# Altium schematic sheet [03] - MCU.SchDoc
size A3; DocumentNumber: 4; SheetNumber: 4; SheetTotal: 6
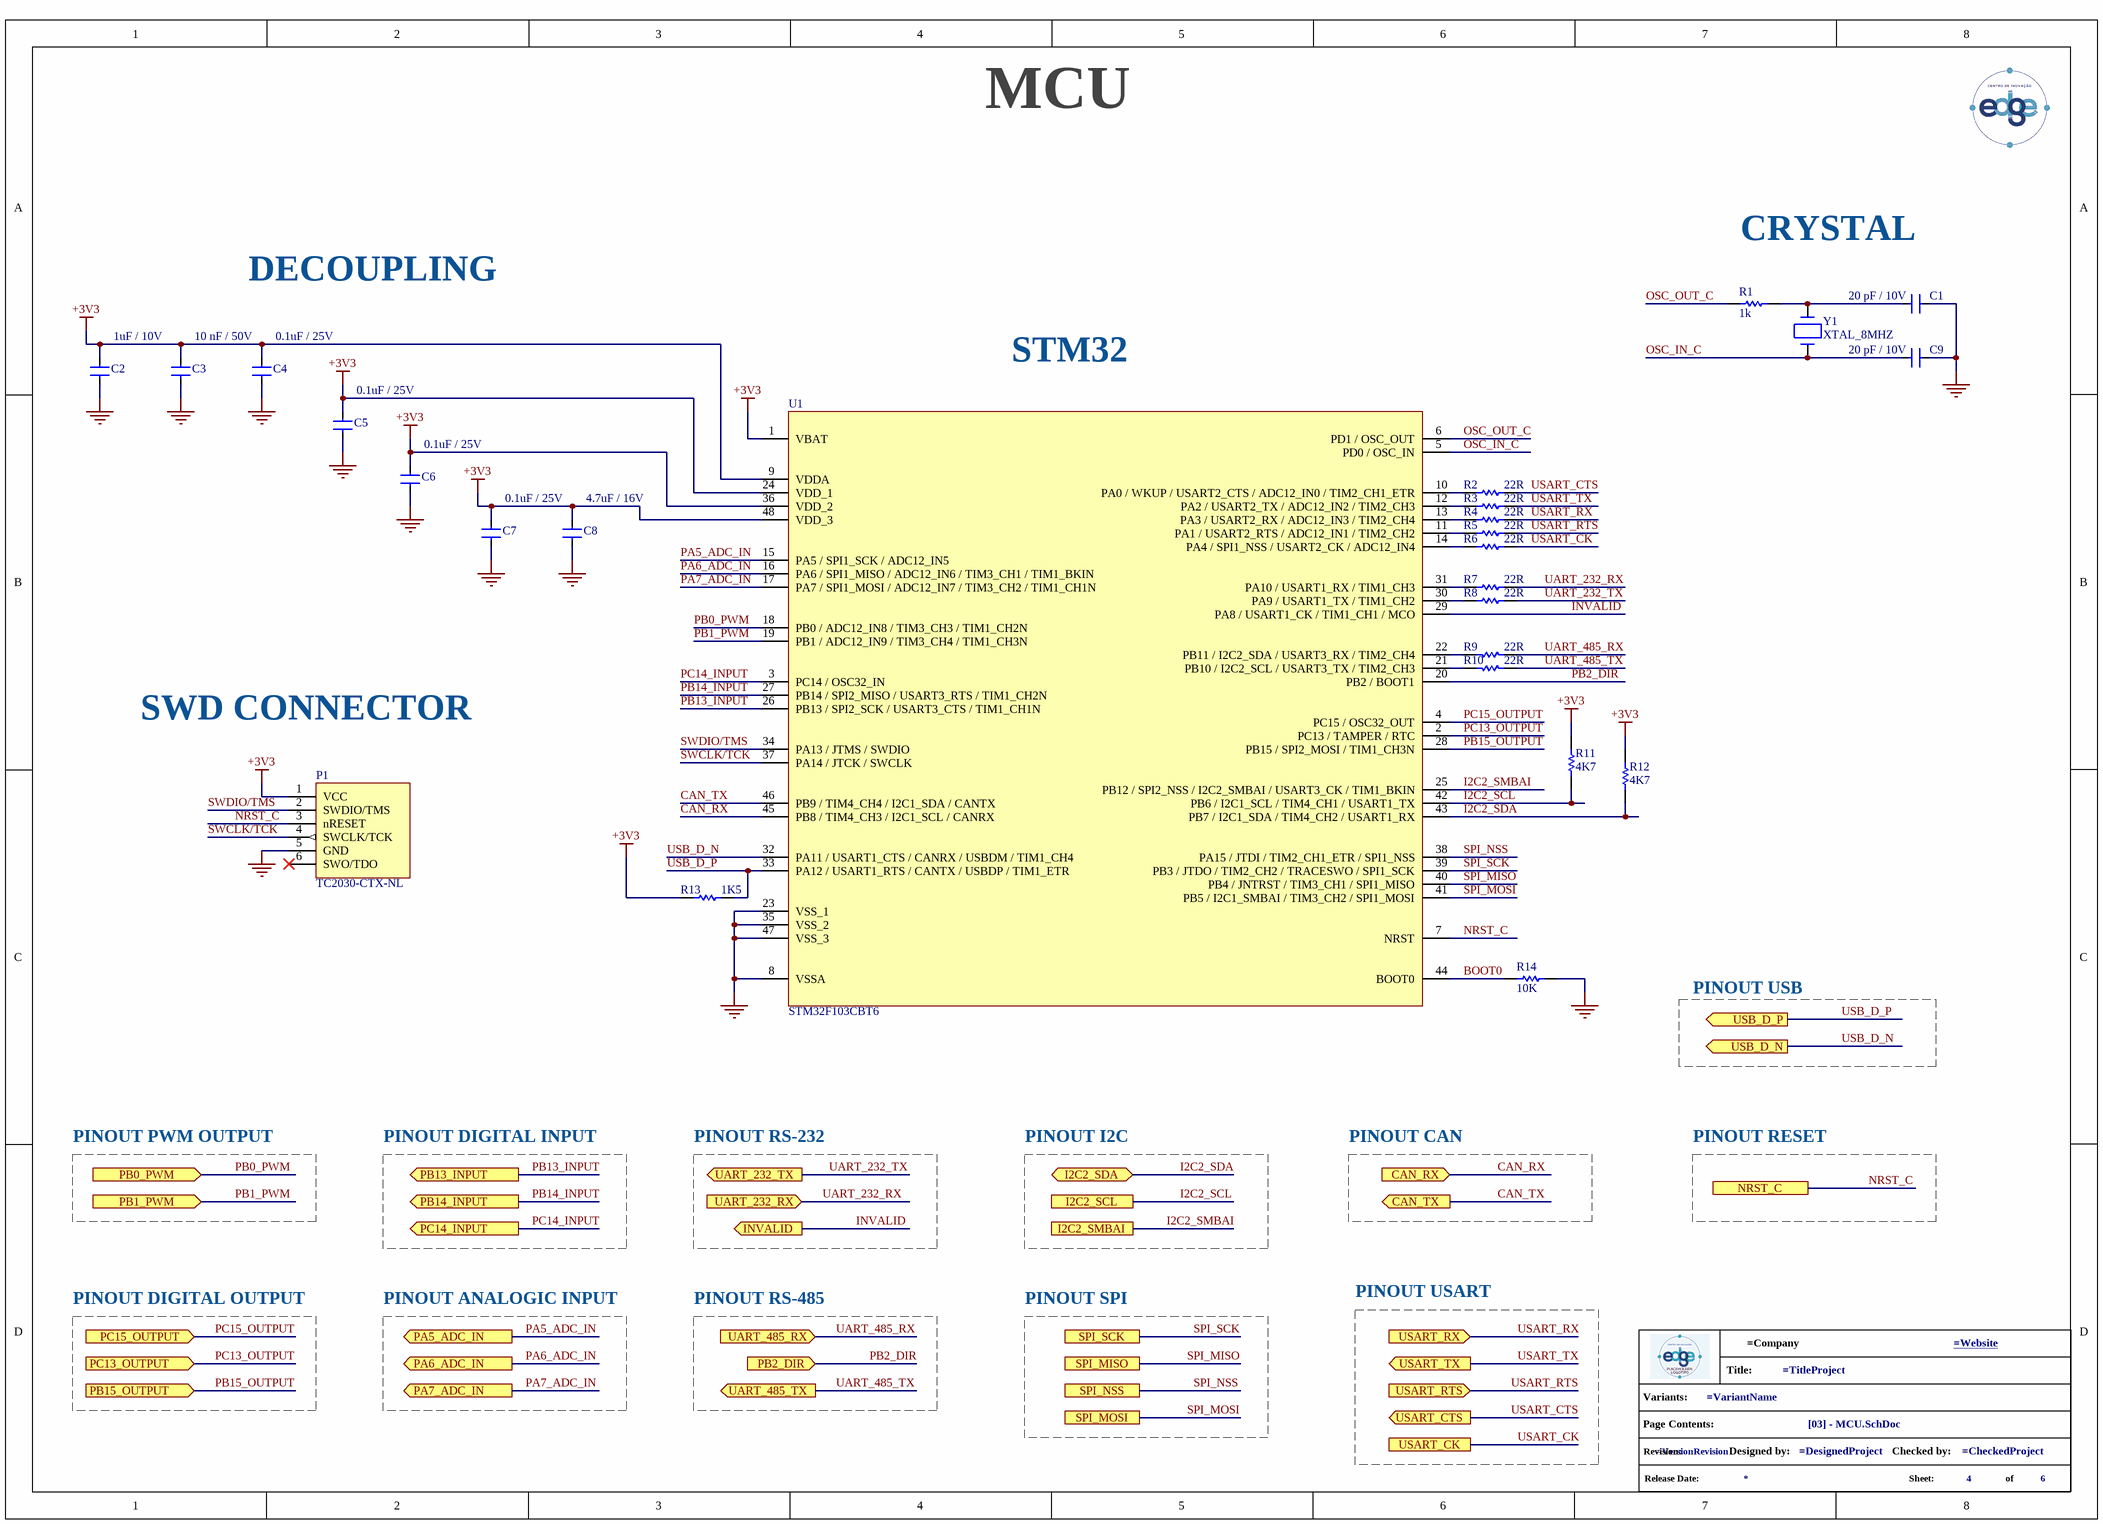
[diagram p0: [03] - MCU.SchDoc]

## Parts
*?  info_project  (value not drawn)  (graphical)
C1  20 pF / 10V  [C0805]
C2  1uF / 10V  [C0805]
C3  10 nF / 50V  [C0805]
C4  0.1uF / 25V  [C0805]
C5  0.1uF / 25V  [C0805]
C6  0.1uF / 25V  [C0805]
C7  0.1uF / 25V  [C0805]
C8  4.7uF / 16V  [C0805]
C9  20 pF / 10V  [C0805]
P1  TC2030-CTX-NL  [TC2030-CTX-NL]  (no BOM)
R1  1k  [R0805]
R2  22R  [R0805]
R3  22R  [R0805]
R4  22R  [R0805]
R5  22R  [R0805]
R6  22R  [R0805]
R7  22R  [R0805]
R8  22R  [R0805]
R9  22R  [R0805]
R10  22R  [R0805]
R11  4K7  [R0805]
R12  4K7  [R0805]
R13  1K5  [R0805]
R14  10K  [R0805]
U1  STM32F103CBT6  [STM32F103CBT6]
Y1  XTAL_8MHZ  [ABM7-8.000MHZ-D2Y-T]

## Ports
CAN_RX (in), CAN_TX (out), I2C2_SCL, I2C2_SDA (bidir), I2C2_SMBAI, INVALID (out), NRST_C, PA5_ADC_IN (out), PA6_ADC_IN (out), PA7_ADC_IN (out), PB0_PWM (in), PB1_PWM (in), PB2_DIR (in), PB13_INPUT (out), PB14_INPUT (out), PB15_OUTPUT (in), PC13_OUTPUT (in), PC14_INPUT (out), PC15_OUTPUT (in), SPI_MISO, SPI_MOSI, SPI_NSS, SPI_SCK, UART_232_RX (in), UART_232_TX (out), UART_485_RX (in), UART_485_TX (out), USART_CK, USART_CTS (out), USART_RTS (in), USART_RX (in), USART_TX (out), USB_D_N (out), USB_D_P (out)

## Nets
+3V3: C2.1 C3.1 C4.2 C5.2 C6.1 C7.1 C8.2 P1.1(VCC) R11.2 R12.2 R13.1 U1.1(VBAT) U1.9(VDDA) U1.24(VDD_1) U1.36(VDD_2) U1.48(VDD_3)
GND: C1.2 C2.2 C3.2 C4.1 C5.1 C6.2 C7.2 C8.1 C9.2 P1.5(GND) R14.1 U1.8(VSSA) U1.23(VSS_1) U1.35(VSS_2) U1.47(VSS_3)
BOOT0: R14.2 U1.44(BOOT0)
CAN_RX: U1.45(PB8_/_TIM4_CH3_/_I2C1_SCL_/_CANRX) ; port CAN_RX
CAN_TX: U1.46(PB9_/_TIM4_CH4_/_I2C1_SDA_/_CANTX) ; port CAN_TX
I2C2_SCL: R11.1 U1.42(PB6_/_I2C1_SCL_/_TIM4_CH1_/_USART1_TX) ; port I2C2_SCL
I2C2_SDA: R12.1 U1.43(PB7_/_I2C1_SDA_/_TIM4_CH2_/_USART1_RX) ; port I2C2_SDA
I2C2_SMBAI: U1.25(PB12_/_SPI2_NSS_/_I2C2_SMBAI_/_USART3_CK_/_TIM1_BKIN) ; port I2C2_SMBAI
INVALID: U1.29(PA8_/_USART1_CK_/_TIM1_CH1_/_MCO) ; port INVALID
NRST_C: P1.3(nRESET) U1.7(NRST) ; port NRST_C
OSC_IN_C: C9.1 U1.5(PD0_/_OSC_IN) Y1.1
OSC_OUT_C: R1.1 U1.6(PD1_/_OSC_OUT)
PA5_ADC_IN: U1.15(PA5_/_SPI1_SCK_/_ADC12_IN5) ; port PA5_ADC_IN
PA6_ADC_IN: U1.16(PA6_/_SPI1_MISO_/_ADC12_IN6_/_TIM3_CH1_/_TIM1_BKIN) ; port PA6_ADC_IN
PA7_ADC_IN: U1.17(PA7_/_SPI1_MOSI_/_ADC12_IN7_/_TIM3_CH2_/_TIM1_CH1N) ; port PA7_ADC_IN
PB0_PWM: U1.18(PB0_/_ADC12_IN8_/_TIM3_CH3_/_TIM1_CH2N) ; port PB0_PWM
PB1_PWM: U1.19(PB1_/_ADC12_IN9_/_TIM3_CH4_/_TIM1_CH3N) ; port PB1_PWM
PB2_DIR: U1.20(PB2_/_BOOT1) ; port PB2_DIR
PB13_INPUT: U1.26(PB13_/_SPI2_SCK_/_USART3_CTS_/_TIM1_CH1N) ; port PB13_INPUT
PB14_INPUT: U1.27(PB14_/_SPI2_MISO_/_USART3_RTS_/_TIM1_CH2N) ; port PB14_INPUT
PB15_OUTPUT: U1.28(PB15_/_SPI2_MOSI_/_TIM1_CH3N) ; port PB15_OUTPUT
PC13_OUTPUT: U1.2(PC13_/_TAMPER_/_RTC) ; port PC13_OUTPUT
PC14_INPUT: U1.3(PC14_/_OSC32_IN) ; port PC14_INPUT
PC15_OUTPUT: U1.4(PC15_/_OSC32_OUT) ; port PC15_OUTPUT
SPI_MISO: U1.40(PB4_/_JNTRST_/_TIM3_CH1_/_SPI1_MISO) ; port SPI_MISO
SPI_MOSI: U1.41(PB5_/_I2C1_SMBAI_/_TIM3_CH2_/_SPI1_MOSI) ; port SPI_MOSI
SPI_NSS: U1.38(PA15_/_JTDI_/_TIM2_CH1_ETR_/_SPI1_NSS) ; port SPI_NSS
SPI_SCK: U1.39(PB3_/_JTDO_/_TIM2_CH2_/_TRACESWO_/_SPI1_SCK) ; port SPI_SCK
SWCLK/TCK: P1.4(SWCLK/TCK) U1.37(PA14_/_JTCK_/_SWCLK)
SWDIO/TMS: P1.2(SWDIO/TMS) U1.34(PA13_/_JTMS_/_SWDIO)
UART_232_RX: R7.2 ; port UART_232_RX
UART_232_TX: R8.2 ; port UART_232_TX
UART_485_RX: R9.1 ; port UART_485_RX
UART_485_TX: R10.1 ; port UART_485_TX
USART_CK: R6.1 ; port USART_CK
USART_CTS: R2.1 ; port USART_CTS
USART_RTS: R5.1 ; port USART_RTS
USART_RX: R4.1 ; port USART_RX
USART_TX: R3.1 ; port USART_TX
USB_D_N: U1.32(PA11_/_USART1_CTS_/_CANRX_/_USBDM_/_TIM1_CH4) ; port USB_D_N
USB_D_P: R13.2 U1.33(PA12_/_USART1_RTS_/_CANTX_/_USBDP_/_TIM1_ETR) ; port USB_D_P
NetC1_1: C1.1 R1.2 Y1.2
NetR2_2: R2.2 U1.10(PA0_/_WKUP_/_USART2_CTS_/_ADC12_IN0_/_TIM2_CH1_ETR)
NetR3_2: R3.2 U1.12(PA2_/_USART2_TX_/_ADC12_IN2_/_TIM2_CH3)
NetR4_2: R4.2 U1.13(PA3_/_USART2_RX_/_ADC12_IN3_/_TIM2_CH4)
NetR5_2: R5.2 U1.11(PA1_/_USART2_RTS_/_ADC12_IN1_/_TIM2_CH2)
NetR6_2: R6.2 U1.14(PA4_/_SPI1_NSS_/_USART2_CK_/_ADC12_IN4)
NetR7_1: R7.1 U1.31(PA10_/_USART1_RX_/_TIM1_CH3)
NetR8_1: R8.1 U1.30(PA9_/_USART1_TX_/_TIM1_CH2)
NetR9_2: R9.2 U1.22(PB11_/_I2C2_SDA_/_USART3_RX_/_TIM2_CH4)
NetR10_2: R10.2 U1.21(PB10_/_I2C2_SCL_/_USART3_TX_/_TIM2_CH3)

Not connected (* = marked no-connect by the designer): P1 6(SWO/TDO)*

## Notes on the sheet
- MCU
- CRYSTAL
- DECOUPLING
- STM32
- SWD CONNECTOR
- PINOUT USB
- PINOUT PWM OUTPUT
- PINOUT DIGITAL INPUT
- PINOUT RS-232
- PINOUT I2C
- PINOUT CAN
- PINOUT RESET
- PINOUT DIGITAL OUTPUT
- PINOUT ANALOGIC INPUT
- PINOUT RS-485
- PINOUT SPI
- PINOUT USART
- (in symbol info_project) Title:; Variants:; Page Contents:; Revision:; Designed by:; Checked by:; Release Date:; Sheet:; of

## Library data of the parts
C1 C9 = C0805C200G8HAC7800: MLCC - 20pF 10V 0805 X8R +/- 2%; Manufacturer: KEMET; Supplier 1: Digi-Key; Manufacturer Part Number: C0805C200G8HAC7800; RoHS: No; Stock 1: 11310; Pricing 1: 1=0,18000, 10=0,12800, 50=0,07240, 100=0,06000, 500=0,04208, 1000=0,03484 (USD); Supplier Part Number 1: 399-C0805C200G8HAC7800CT-ND
C2 = LMF212B7105KGHT: MLCC - 1uF 10V 0805   X7R +/- 10%; Manufacturer: Taiyo Yuden; Supplier 1: Digi-Key; Manufacturer Part Number: LMF212B7105KGHT; RoHS: Yes; Stock 1: 5962; Pricing 1: 1=0.31000, 10=0.21100, 50=0.14040, 100=0.11930, 500=0.08422, 1000=0.07369 (USD); RoHS Compliant: Yes; Supplier Part Number 1: 587-6522-1-ND
C3 = C0805C103J5GEC7800: MLCC - 10nF 50V 0805 C0G +/- 5%; Manufacturer: KEMET; Supplier 1: Digi-Key; Manufacturer Part Number: C0805C103J5GEC7800; RoHS: No; Stock 1: 1119; Pricing 1: 1=0.31000, 10=0.21500, 50=0.14300, 100=0.12160, 500=0.08584, 1000=0.07511 (USD); Supplier Part Number 1: 399-C0805C103J5GEC7800CT-ND
C4-C7 = CC0805KRX7R8BB104: MLCC - 0.1uF 25V 0805 X7R +/- 10%; Manufacturer: Yageo; Material: Ceramic; Capacitance: 100nF; Insulation Resistance: 100GR; Supplier 1: Digi-Key; Manufacturer Part Number: CC0805KRX7R8BB104; RoHS: Yes; Category: Ceramic Capacitors; Stock 1: 331734; Pricing 1: 1=0,12000, 10=0,08800, 50=0,04980, 100=0,04130, 500=0,02894, 1000=0,02396 (USD); Mount: Surface Mount; Case/Package: 0805; Number of Pins: 2; Case Code (Metric): 2012; Case Code (Imperial): 0805; Min Operating Temperature: -55°C; Max Operating Temperature: 125°C; Tolerance: 10%; Dielectric: X7R; Series: CC; Package Quantity: 1; Voltage Rating: 25V; Packaging: Tape and Reel; Voltage Rating (DC): 25V; Termination: SMD/SMT; Resistor Type: Ceramic; Length: 2mm; Width: 0.049inch; Height: 0.85mm; Depth: 1.25mm; Thickness: 0.033inch; Radiation Hardening: No; RoHS Compliant: Yes; REACH SVHC: No SVHC; Lead Free: Lead Free; Halogen Free: Halogen Free; ComponentLink1URL: https://datasheet.ciiva.com/145/mlccorderingcode-145007.pdf?src-supplier=Digi-Key; ComponentLink1Description: https://datasheet.ciiva.com/145/mlccorderingcode-145007.pdf?src-supplier=Digi-Key; ComponentLink2URL: https://datasheet.ciiva.com/145/mlccorderingcode-145008.pdf?src-supplier=Digi-Key; ComponentLink2Description: https://datasheet.ciiva.com/145/mlccorderingcode-145008.pdf?src-supplier=Digi-Key; ComponentLink3URL: https://datasheet.ciiva.com/145/mlccorderingcode-145009.pdf?src-supplier=Digi-Key; ComponentLink3Description: https://datasheet.ciiva.com/145/mlccorderingcode-145009.pdf?src-supplier=Digi-Key; ComponentLink4URL: https://datasheet.ciiva.com/8034/1784427-8034029.pdf?src-supplier=Element14; ComponentLink4Description: https://datasheet.ciiva.com/8034/1784427-8034029.pdf?src-supplier=Element14; ComponentLink5URL: https://datasheet.ciiva.com/8034/1784427-8034030.pdf?src-supplier=Element14; ComponentLink5Description: https://datasheet.ciiva.com/8034/1784427-8034030.pdf?src-supplier=Element14; ComponentLink6URL: https://datasheet.ciiva.com/8034/70765-8034031.pdf?src-supplier=Element14; ComponentLink6Description: https://datasheet.ciiva.com/8034/70765-8034031.pdf?src-supplier=Element14; ComponentLink7URL: https://datasheet.ciiva.com/46430/1850775-46430166.pdf?src-supplier=Element14; ComponentLink7Description: https://datasheet.ciiva.com/46430/1850775-46430166.pdf?src-supplier=Element14; ComponentLink8URL: https://datasheet.ciiva.com/28450/1489800-28450789.pdf?src-supplier=Element14; ComponentLink8Description: https://datasheet.ciiva.com/28450/1489800-28450789.pdf?src-supplier=Element14; ComponentLink9URL: https://datasheet.ciiva.com/15189/getdatasheetpartid-330244-15189223.pdf?src-supplier=Verical; ComponentLink9Description: https://datasheet.ciiva.com/15189/getdatasheetpartid-330244-15189223.pdf?src-supplier=Verical; ComponentLink10URL: https://datasheet.ciiva.com/16625/upy-gphc-x7r-6-3v-to-50v-8-16625546.pdf?src-supplier=Avnet+Europe; ComponentLink10Description: https://datasheet.ciiva.com/16625/upy-gphc-x7r-6-3v-to-50v-8-16625546.pdf?src-supplier=Avnet+Europe; Supplier Part Number 1: 311-1141-1-ND
C8 = GCM21BR71C475KA73L: MLCC - 4.7uF 16V 0805 X7R +/- 10%; Manufacturer: Murata; Supplier 1: Digi-Key; Manufacturer Part Number: GCM21BR71C475KA73L; RoHS: Yes; Category: Ceramic Capacitors; Stock 1: 262759; Pricing 1: 1=0,37000, 10=0,25300, 50=0,16900, 100=0,14360, 500=0,10138, 1000=0,08870 (USD); Mount: Surface Mount; Case/Package: 0805; Case Code (Metric): 2012; Case Code (Imperial): 0805; Weight: 0.000335oz; Min Operating Temperature: -55°C; Max Operating Temperature: 125°C; Tolerance: 10%; Capacitance: 4.7uF; Dielectric: X7R; Voltage Rating: 16V; Packaging: Tape and Reel; Package Quantity: 1; Voltage: 16V; Termination: SMD/SMT; Voltage Rating (DC): 16V; Series: GCM; Construction: Flat; Length: 2mm; Width: 0.049inch; Height: 1.25mm; Thickness: 0.055inch; Depth: 1.25mm; Ratings: AEC-Q200; Radiation Hardening: No; REACH SVHC: No SVHC; Lead Free: Lead Free; RoHS Compliant: Yes; ComponentLink1URL: https://datasheet.ciiva.com/11613/product-11613410.pdf?src-supplier=Avnet; ComponentLink1Description: https://datasheet.ciiva.com/11613/product-11613410.pdf?src-supplier=Avnet; ComponentLink2URL: https://datasheet.ciiva.com/11787/0900766b80ef92d0-11787002.pdf?src-supplier=RSComponents; ComponentLink2Description: https://datasheet.ciiva.com/11787/0900766b80ef92d0-11787002.pdf?src-supplier=RSComponents; ComponentLink3URL: https://datasheet.ciiva.com/140/s0717e-140483.pdf?src-supplier=Digi-Key; ComponentLink3Description: https://datasheet.ciiva.com/140/s0717e-140483.pdf?src-supplier=Digi-Key; ComponentLink4URL: https://datasheet.ciiva.com/140/s0717e-140484.pdf?src-supplier=Digi-Key; ComponentLink4Description: https://datasheet.ciiva.com/140/s0717e-140484.pdf?src-supplier=Digi-Key; Supplier Part Number 1: 490-5332-1-ND
P1 = TC2030-CTX-NL: 6 pin Tag-Connect; .SCHChecked: Alex Batista; .PCBChecked: Alex Batista
R1 = RC0805FR-071KL: RES - 1K 1/8W 0805 1%; Manufacturer: Yageo; Resistance: 1kR; Temperature Coefficient: 100ppm/°C; Voltage Rating (DC): 150V; Power Rating: 125mW; Supplier 1: Digi-Key; Manufacturer Part Number: RC0805FR-071KL; RoHS: Yes; Category: Chip SMD Resistors; Stock 1: 7991149; Pricing 1: 1=0,10000, 10=0,04200, 100=0,01690, 1000=0,00759, 2500=0,00659 (USD); Case/Package: 0805; Number of Pins: 2; Case Code (Metric): 2012; Case Code (Imperial): 0805; Size Code: 0805; Min Operating Temperature: -55°C; Max Operating Temperature: 155°C; Tolerance: 1%; Resistor Type: Thick Film; Packaging: Tape and Reel; Package Quantity: 1; Voltage Rating: 150V; Number of Terminations: 2; Termination: SMD/SMT; Max Power Dissipation: 125mW; Features: Moisture Resistant; Series: RC; Resistance Tolerance: 1%; Construction: Rectangular; Length: 0.079inch; Width: 0.049inch; Height: 0.024inch; Depth: 1.25mm; REACH SVHC: Unknown; Lead Free: Lead Free; RoHS Compliant: Yes; Military Standard: Not; ComponentLink1URL: https://datasheet.ciiva.com/46385/444164-46385020.pdf?src-supplier=Element14; ComponentLink1Description: https://datasheet.ciiva.com/46385/444164-46385020.pdf?src-supplier=Element14; ComponentLink2URL: https://datasheet.ciiva.com/2456/pyu-r-int-thick-7-2456975.pdf?src-supplier=Digi-Key; ComponentLink2Description: https://datasheet.ciiva.com/2456/pyu-r-int-thick-7-2456975.pdf?src-supplier=Digi-Key; ComponentLink3URL: https://datasheet.ciiva.com/2456/pyu-r-int-thick-7-2456976.pdf?src-supplier=Digi-Key; ComponentLink3Description: https://datasheet.ciiva.com/2456/pyu-r-int-thick-7-2456976.pdf?src-supplier=Digi-Key; ComponentLink4URL: https://datasheet.ciiva.com/2456/pyu-r-int-thick-7-2456977.pdf?src-supplier=Digi-Key; ComponentLink4Description: https://datasheet.ciiva.com/2456/pyu-r-int-thick-7-2456977.pdf?src-supplier=Digi-Key; ComponentLink5URL: https://datasheet.ciiva.com/16850/rc0805-16850409.pdf?src-supplier=Future+Electronics; ComponentLink5Description: https://datasheet.ciiva.com/16850/rc0805-16850409.pdf?src-supplier=Future+Electronics; ComponentLink6URL: https://datasheet.ciiva.com/7941/1686128-7941719.pdf?src-supplier=Element14; ComponentLink6Description: https://datasheet.ciiva.com/7941/1686128-7941719.pdf?src-supplier=Element14; Supplier Part Number 1: 311-1.00KCRCT-ND
R2-R10 = RC0805FR-0722RL: RES - 22R 1/8W 0805 1%; Manufacturer: Yageo; Temperature Coefficient: 100ppm/°C; Power Rating: 125mW; Voltage Rating: 150V; Supplier 1: Digi-Key; Manufacturer Part Number: RC0805FR-0722RL; RoHS: Yes; Category: Chip SMD Resistors; Stock 1: 534010; Pricing 1: 1=0,10000, 10=0,04200, 100=0,01690, 1000=0,00759, 2500=0,00659 (USD); Case/Package: 0805; Case Code (Metric): 2012; Case Code (Imperial): 0805; Min Operating Temperature: -55°C; Max Operating Temperature: 155°C; Resistor Type: Thick Film; Resistance: 22R; Tolerance: 1%; Packaging: Tape and Reel; Package Quantity: 1; Number of Terminations: 2; Termination: SMD/SMT; Max Power Dissipation: 125mW; Working Voltage: 150V; Features: Moisture Resistant; Series: RC; Resistance Tolerance: 1%; Construction: Rectangular; Technology: THICK FILM; Length: 0.079inch; Width: 0.049inch; Height: 0.024inch; Depth: 1.25mm; RoHS Compliant: Yes; REACH SVHC: Unknown; Military Standard: Not; Lead Free: Lead Free; ComponentLink1URL: https://datasheet.ciiva.com/11819/0900766b8106beab-11819837.pdf?src-supplier=RSComponents; ComponentLink1Description: https://datasheet.ciiva.com/11819/0900766b8106beab-11819837.pdf?src-supplier=RSComponents; ComponentLink2URL: https://datasheet.ciiva.com/46447/444164-46447574.pdf?src-supplier=Element14; ComponentLink2Description: https://datasheet.ciiva.com/46447/444164-46447574.pdf?src-supplier=Element14; ComponentLink3URL: https://datasheet.ciiva.com/2457/pyu-r-int-thick-7-2457045.pdf?src-supplier=Digi-Key; ComponentLink3Description: https://datasheet.ciiva.com/2457/pyu-r-int-thick-7-2457045.pdf?src-supplier=Digi-Key; ComponentLink4URL: https://datasheet.ciiva.com/2457/pyu-r-int-thick-7-2457046.pdf?src-supplier=Digi-Key; ComponentLink4Description: https://datasheet.ciiva.com/2457/pyu-r-int-thick-7-2457046.pdf?src-supplier=Digi-Key; ComponentLink5URL: https://datasheet.ciiva.com/2457/pyu-r-int-thick-7-2457044.pdf?src-supplier=Digi-Key; ComponentLink5Description: https://datasheet.ciiva.com/2457/pyu-r-int-thick-7-2457044.pdf?src-supplier=Digi-Key; ComponentLink6URL: https://datasheet.ciiva.com/12667/rc0805-12667371.pdf?src-supplier=Mouser; ComponentLink6Description: https://datasheet.ciiva.com/12667/rc0805-12667371.pdf?src-supplier=Mouser; Supplier Part Number 1: 311-22.0CRCT-ND
R11 R12 = CRCW08054K70FKEA: RES - 4.7K 1/8W 0805 1%; Manufacturer: Vishay; Resistance: 4.7kR; Power Rating: 125mW; Temperature Coefficient: 100ppm/°C; Voltage Rating: 150V; Supplier 1: RSComponents; Manufacturer Part Number: CRCW08054K70FKEA; RoHS: Yes; Category: Chip SMD Resistors; Stock 1: 1; Pricing 1: 50=0.07500, 250=0.06800, 500=0.05500, 750=0.04400, 1000=0.03700 (USD); Case/Package: 0805; Contact Plating: Tin; Weight: 0.000194oz; Case Code (Imperial): 0805; Case Code (Metric): 2012; Size Code: 0805; Min Operating Temperature: -55°C; Max Operating Temperature: 155°C; Tolerance: 1%; Resistor Type: Thick Film; Termination: SMD/SMT; Packaging: Tape and Reel; Package Quantity: 10; Number of Terminations: 2; Max Power Dissipation: 125mW; Voltage Rating (DC): 150V; Features: Automotive AEC-Q200; Series: CRCW; Resistance Tolerance: 1%; Technology: THICK FILM; Construction: Rectangular; Length: 2mm; Width: 1.25mm; Height: 0.45mm; Depth: 1.25mm; Radiation Hardening: No; Lead Free: Lead Free; RoHS Compliant: Yes; REACH SVHC: Unknown; Military Standard: Not; ComponentLink1URL: https://datasheet.ciiva.com/11808/0900766b80d98b26-11808992.pdf?src-supplier=RSComponents; ComponentLink1Description: https://datasheet.ciiva.com/11808/0900766b80d98b26-11808992.pdf?src-supplier=RSComponents; ComponentLink2URL: https://datasheet.ciiva.com/2467/dcrcwe3-2467437.pdf?src-supplier=Digi-Key; ComponentLink2Description: https://datasheet.ciiva.com/2467/dcrcwe3-2467437.pdf?src-supplier=Digi-Key; ComponentLink3URL: https://datasheet.ciiva.com/2467/dcrcwe3-2467438.pdf?src-supplier=Digi-Key; ComponentLink3Description: https://datasheet.ciiva.com/2467/dcrcwe3-2467438.pdf?src-supplier=Digi-Key; ComponentLink4URL: https://datasheet.ciiva.com/2467/dcrcwe3-2467439.pdf?src-supplier=Digi-Key; ComponentLink4Description: https://datasheet.ciiva.com/2467/dcrcwe3-2467439.pdf?src-supplier=Digi-Key; ComponentLink5URL: https://datasheet.ciiva.com/5550/dcrcwe3-109170-5550903.pdf?src-supplier=Mouser; ComponentLink5Description: https://datasheet.ciiva.com/5550/dcrcwe3-109170-5550903.pdf?src-supplier=Mouser; ComponentLink6URL: https://datasheet.ciiva.com/9071/dcrcwe3-9071196.pdf?src-supplier=Avnet; ComponentLink6Description: https://datasheet.ciiva.com/9071/dcrcwe3-9071196.pdf?src-supplier=Avnet; ComponentLink7URL: https://datasheet.ciiva.com/26317/fld-crcw-e3-data-en-26317145.pdf?src-supplier=Distrelec; ComponentLink7Description: https://datasheet.ciiva.com/26317/fld-crcw-e3-data-en-26317145.pdf?src-supplier=Distrelec; ComponentLink8URL: https://datasheet.ciiva.com/16213/dcrcwe3-16213733.pdf?src-supplier=Future+Electronics; ComponentLink8Description: https://datasheet.ciiva.com/16213/dcrcwe3-16213733.pdf?src-supplier=Future+Electronics; ComponentLink9URL: https://datasheet.ciiva.com/16720/70201119-16720438.pdf?src-supplier=Allied+Electronics; ComponentLink9Description: https://datasheet.ciiva.com/16720/70201119-16720438.pdf?src-supplier=Allied+Electronics; Supplier Part Number 1: 6791496P
R13 = ERJ-6GEYJ152V: RES - 1.5K 1/8W 0805 5%; Manufacturer: Panasonic; Resistance: 1.5kR; Temperature Coefficient: 200ppm/°C; Power Rating: 125mW; Voltage Rating: 150V; Supplier 1: Digi-Key; Manufacturer Part Number: ERJ-6GEYJ152V; RoHS: Yes; Category: Chip SMD Resistors; Stock 1: 100295; Pricing 1: 1=0.10000, 10=0.05700, 100=0.02310, 1000=0.01036, 2500=0.00899 (USD); Mount: Surface Mount; Case/Package: 0805; Contact Plating: Tin; Case Code (Metric): 2012; Case Code (Imperial): 0805; Min Operating Temperature: -55°C; Max Operating Temperature: 155°C; Tolerance: 5%; Resistor Type: Thick Film; Packaging: Tape and Reel; Package Quantity: 5000; Number of Terminations: 2; Termination: SMD/SMT; Max Power Dissipation: 125mW; Voltage Rating (DC): 150V; Series: ERJ; Technology: THICK FILM; Construction: Rectangular; Resistance Tolerance: 5%; Length: 2mm; Width: 0.049inch; Height: 0.6mm; Depth: 1.25mm; Radiation Hardening: No; REACH SVHC: No SVHC; Military Standard: Not; Lead Free: Lead Free; RoHS Compliant: Yes; ComponentLink1URL: https://datasheet.ciiva.com/34303/1989691-34303649.pdf?src-supplier=Jameco; ComponentLink1Description: https://datasheet.ciiva.com/34303/1989691-34303649.pdf?src-supplier=Jameco; ComponentLink2URL: https://datasheet.ciiva.com/11821/0900766b80f806dd-11821558.pdf?src-supplier=RSComponents; ComponentLink2Description: https://datasheet.ciiva.com/11821/0900766b80f806dd-11821558.pdf?src-supplier=RSComponents; ComponentLink3URL: https://datasheet.ciiva.com/22758/1500035-22758236.pdf?src-supplier=Farnell; ComponentLink3Description: https://datasheet.ciiva.com/22758/1500035-22758236.pdf?src-supplier=Farnell; ComponentLink4URL: https://datasheet.ciiva.com/43460/1500035-43460111.pdf?src-supplier=Farnell; ComponentLink4Description: https://datasheet.ciiva.com/43460/1500035-43460111.pdf?src-supplier=Farnell; ComponentLink5URL: https://datasheet.ciiva.com/16513/aoa0000ce1-16513737.pdf?src-supplier=Avnet+Asia; ComponentLink5Description: https://datasheet.ciiva.com/16513/aoa0000ce1-16513737.pdf?src-supplier=Avnet+Asia; ComponentLink6URL: https://datasheet.ciiva.com/17214/aoa0000ce1-17214765.pdf?src-supplier=Avnet+Europe; ComponentLink6Description: https://datasheet.ciiva.com/17214/aoa0000ce1-17214765.pdf?src-supplier=Avnet+Europe; ComponentLink7URL: https://datasheet.ciiva.com/46380/1500035-46380938.pdf?src-supplier=Element14; ComponentLink7Description: https://datasheet.ciiva.com/46380/1500035-46380938.pdf?src-supplier=Element14; ComponentLink8URL: https://datasheet.ciiva.com/46389/1500035-46389822.pdf?src-supplier=Element14; ComponentLink8Description: https://datasheet.ciiva.com/46389/1500035-46389822.pdf?src-supplier=Element14; ComponentLink9URL: https://datasheet.ciiva.com/28514/1678796-28514239.pdf?src-supplier=Element14; ComponentLink9Description: https://datasheet.ciiva.com/28514/1678796-28514239.pdf?src-supplier=Element14; ComponentLink10URL: https://datasheet.ciiva.com/30181/4aoa0000ce1-30181306.pdf?src-supplier=Onlinecomponents.com; ComponentLink10Description: https://datasheet.ciiva.com/30181/4aoa0000ce1-30181306.pdf?src-supplier=Onlinecomponents.com; ComponentLink11URL: https://datasheet.ciiva.com/16768/70255313-16768838.pdf?src-supplier=Allied+Electronics; ComponentLink11Description: https://datasheet.ciiva.com/16768/70255313-16768838.pdf?src-supplier=Allied+Electronics; ComponentLink12URL: https://datasheet.ciiva.com/16764/70255313-16764710.pdf?src-supplier=Allied+Electronics; ComponentLink12Description: https://datasheet.ciiva.com/16764/70255313-16764710.pdf?src-supplier=Allied+Electronics; Supplier Part Number 1: P1.5KACT-ND
R14 = RC0805FR-0710KL: RES - 10K  1/8W 0805 1%; Manufacturer: Yageo; Resistance: 10kR; Temperature Coefficient: 100ppm/°C; Power Rating: 125mW; Voltage Rating: 150V; Supplier 1: Digi-Key; Manufacturer Part Number: RC0805FR-0710KL; RoHS: Yes; Category: Chip SMD Resistors; Stock 1: 5866675; Pricing 1: 1=0,10000, 10=0,04200, 100=0,01690, 1000=0,00759, 2500=0,00659 (USD); Case/Package: 0805; Case Code (Imperial): 0805; Case Code (Metric): 2012; Size Code: 0805; Min Operating Temperature: -55°C; Max Operating Temperature: 155°C; Tolerance: 1%; Resistor Type: Thick Film; Packaging: Tape and Reel; Package Quantity: 1; Termination: SMD/SMT; Number of Terminations: 2; Max Power Dissipation: 125mW; Features: Moisture Resistant; Series: RC; Construction: Rectangular; Resistance Tolerance: 1%; Technology: THICK FILM; Length: 2mm; Width: 0.049inch; Height: 0.024inch; Depth: 1.25mm; REACH SVHC: Unknown; Military Standard: Not; Lead Free: Lead Free; RoHS Compliant: Yes; ComponentLink1URL: https://datasheet.ciiva.com/11808/0900766b8106beab-11808151.pdf?src-supplier=RSComponents; ComponentLink1Description: https://datasheet.ciiva.com/11808/0900766b8106beab-11808151.pdf?src-supplier=RSComponents; ComponentLink2URL: https://datasheet.ciiva.com/12669/rc0805-12669688.pdf?src-supplier=Mouser; ComponentLink2Description: https://datasheet.ciiva.com/12669/rc0805-12669688.pdf?src-supplier=Mouser; ComponentLink3URL: https://datasheet.ciiva.com/2456/pyu-r-int-thick-7-2456974.pdf?src-supplier=Digi-Key; ComponentLink3Description: https://datasheet.ciiva.com/2456/pyu-r-int-thick-7-2456974.pdf?src-supplier=Digi-Key; ComponentLink4URL: https://datasheet.ciiva.com/2456/pyu-r-int-thick-7-2456972.pdf?src-supplier=Digi-Key; ComponentLink4Description: https://datasheet.ciiva.com/2456/pyu-r-int-thick-7-2456972.pdf?src-supplier=Digi-Key; ComponentLink5URL: https://datasheet.ciiva.com/2456/pyu-r-int-thick-7-2456973.pdf?src-supplier=Digi-Key; ComponentLink5Description: https://datasheet.ciiva.com/2456/pyu-r-int-thick-7-2456973.pdf?src-supplier=Digi-Key; ComponentLink6URL: https://datasheet.ciiva.com/16747/rc0805-16747087.pdf?src-supplier=Future+Electronics; ComponentLink6Description: https://datasheet.ciiva.com/16747/rc0805-16747087.pdf?src-supplier=Future+Electronics; ComponentLink7URL: https://datasheet.ciiva.com/46447/444164-46447563.pdf?src-supplier=Element14; ComponentLink7Description: https://datasheet.ciiva.com/46447/444164-46447563.pdf?src-supplier=Element14; Supplier Part Number 1: 311-10.0KCRCT-ND
U1 = STM32F103CBT6: MCU 32-bit 128KB 2.5V/3.3V 48-Pin LQFP; Manufacturer: STMicroelectronics; RAM Size: 20KB; Max Power Dissipation: 363mW; Interface: I2C,SPI,USB,CAN,IrDA,UART,USART,LIN; Number of I/Os: 37; Number of Timers/Counters: 4; Max Supply Voltage: 3.6V; Frequency: 72MHz; Min Supply Voltage: 2V; Oscillator Type: Internal; Data Bus Width: 32b; Memory Type: FLASH; Watchdog Timer: Yes; Peripherals: POR,PWM,WDT,DMA,Temp Sensor,I2C; Core Architecture: ARM; Number of PWM Channels: 12; Number of ADC Channels: 10; Number of Bits: 32; Number of SPI Channels: 2; Supplier 1: Digi-Key; Manufacturer Part Number: STM32F103CBT6; RoHS: Yes; Category: Microcontrollers; Pricing 1: 1=6.82000, 10=6.12800, 25=5.79320, 80=5.02100, 250=4.76344, 500=4.27424, 1000=3.75498 (USD); Case/Package: LQFP; Number of Pins: 48; Contact Plating: Gold; Min Operating Temperature: -40°C; Max Operating Temperature: 85°C; Package Quantity: 250; Packaging: Tray; Number of Programmable I/O: 37; Max Frequency: 72MHz; Memory Size: 128KB; Series: STM32 F1; Density: 128KB; Number of I2C Channels: 2; Address Bus Width: 32b; Termination: SMD/SMT; Length: 7mm; Width: 7.2mm; Height: 1.45mm; Radiation Hardening: No; REACH SVHC: No SVHC; Lead Free: Lead Free; RoHS Compliant: Yes; ComponentLink1URL: https://datasheet.ciiva.com/15122/getdatasheetpartid-92132-15122195.pdf?src-supplier=Verical; ComponentLink1Description: https://datasheet.ciiva.com/15122/getdatasheetpartid-92132-15122195.pdf?src-supplier=Verical; ComponentLink2URL: https://datasheet.ciiva.com/23669/1714663-23669200.pdf?src-supplier=Newark; ComponentLink2Description: https://datasheet.ciiva.com/23669/1714663-23669200.pdf?src-supplier=Newark; ComponentLink3URL: https://datasheet.ciiva.com/26820/stm32f103cbt6-26820680.pdf?src-supplier=IIIC; ComponentLink3Description: https://datasheet.ciiva.com/26820/stm32f103cbt6-26820680.pdf?src-supplier=IIIC; ComponentLink4URL: https://datasheet.ciiva.com/5752/cd00161566-5752838.pdf?src-supplier=Farnell; ComponentLink4Description: https://datasheet.ciiva.com/5752/cd00161566-5752838.pdf?src-supplier=Farnell; ComponentLink5URL: https://datasheet.ciiva.com/1502/cd00161566-1502328.pdf?src-supplier=Digi-Key; ComponentLink5Description: https://datasheet.ciiva.com/1502/cd00161566-1502328.pdf?src-supplier=Digi-Key; ComponentLink6URL: https://datasheet.ciiva.com/4840/cd00161566-4840398.pdf?src-supplier=Mouser; ComponentLink6Description: https://datasheet.ciiva.com/4840/cd00161566-4840398.pdf?src-supplier=Mouser; ComponentLink7URL: https://datasheet.ciiva.com/16540/cd00161566-16540806.pdf?src-supplier=Avnet+Asia; ComponentLink7Description: https://datasheet.ciiva.com/16540/cd00161566-16540806.pdf?src-supplier=Avnet+Asia; ComponentLink8URL: https://datasheet.ciiva.com/16219/cd00161566-16219150.pdf?src-supplier=Future+Electronics; ComponentLink8Description: https://datasheet.ciiva.com/16219/cd00161566-16219150.pdf?src-supplier=Future+Electronics; ComponentLink9URL: https://datasheet.ciiva.com/14100/pustm-arm-microcont-stm32f103-en-14100509.pdf?src-supplier=Distrelec; ComponentLink9Description: https://datasheet.ciiva.com/14100/pustm-arm-microcont-stm32f103-en-14100509.pdf?src-supplier=Distrelec; Supplier Part Number 1: 497-6288-ND
Y1 = ABM7-8.000MHZ-D2Y-T: ABM7- 8MHZ - SMD - 6mm x 3.5mm - 30 ppm - 18 pF - 20 ppm; Manufacturer: Abracon; Frequency Tolerance: 20ppm; Load Capacitance: 18pF; ESR (Equivalent Series Resistance): 100R; Frequency Stability: 30ppm; Series Resistance: 80R; Supplier 1: Digi-Key; Manufacturer Part Number: ABM7-8.000MHZ-D2Y-T; RoHS: Yes; Category: Crystals; Stock 1: 54566; Pricing 1: 1=0.87000, 10=0.77300, 50=0.72240, 100=0.63840, 500=0.60480 (USD); Mount: Surface Mount; Case/Package: CSMD; Number of Pins: 2; Min Operating Temperature: -40°C; Max Operating Temperature: 85°C; Frequency: 8MHz; Package Quantity: 1000; Packaging: Tape and Reel; Tolerance: 20ppm; Termination: SMD/SMT; Resistor Type: Ceramic; Series: ABM7; Operating Frequency: 8 MHz; Length: 6mm; Width: 0.138inch; Height: 0.055inch; Depth: 3.5mm; Radiation Hardening: No; REACH SVHC: Yes; Lead Free: Lead Free; ComponentLink1URL: https://datasheet.ciiva.com/15116/getdatasheetpartid-722403-15116844.pdf?src-supplier=Verical; ComponentLink1Description: https://datasheet.ciiva.com/15116/getdatasheetpartid-722403-15116844.pdf?src-supplier=Verical; ComponentLink2URL: https://datasheet.ciiva.com/1357/1718755-1357277.pdf?src-supplier=Element14; ComponentLink2Description: https://datasheet.ciiva.com/1357/1718755-1357277.pdf?src-supplier=Element14; ComponentLink3URL: https://datasheet.ciiva.com/29998/abm7-29998171.pdf?src-supplier=Avnet; ComponentLink3Description: https://datasheet.ciiva.com/29998/abm7-29998171.pdf?src-supplier=Avnet; ComponentLink4URL: https://datasheet.ciiva.com/4944/abm7-19096-4944987.pdf?src-supplier=Mouser; ComponentLink4Description: https://datasheet.ciiva.com/4944/abm7-19096-4944987.pdf?src-supplier=Mouser; ComponentLink5URL: https://datasheet.ciiva.com/16416/abm7-16416924.pdf?src-supplier=Future+Electronics; ComponentLink5Description: https://datasheet.ciiva.com/16416/abm7-16416924.pdf?src-supplier=Future+Electronics; Supplier Part Number 1: 535-9831-1-ND